# EAGLE design HDC1080 (EAGLE 7.5.0)
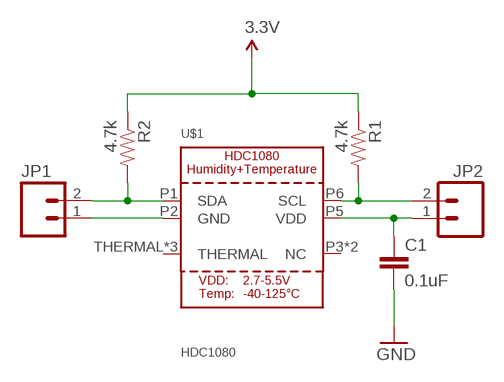
[diagram p0: schematic, sheet 1]

## Parts
C1  0.1uF  0.1UF-25V(+80/-20%)(0603)  [0603-CAP]
JP1  M02PTH  [1X02]
JP2  M02PTH  [1X02]
R1  4.7k  RESISTOR0805-RES  [0805]
R2  4.7k  RESISTOR0805-RES  [0805]
U$1  HDC1080  [PWSON-6]

## Nets
3.3V: C1.1 JP2.1 R1.1 R2.1 U$1.P5(VDD)
GND: C1.2 JP1.1 U$1.P2(GND)
SCL: JP2.2 R1.2 U$1.P6(SCL)
SDA: JP1.2 R2.2 U$1.P1(SDA)
Unconnected: U$1.P3(NC) U$1.P4(NC) U$1.THERMAL U$1.VIA1(THERMAL) U$1.VIA2(THERMAL)

## Library data of the parts
C1 = SparkFun-Capacitors:0.1UF-25V(+80/-20%)(0603): CAP-00810 Ceramic Standard decoupling cap; PROD_ID: CAP-00810
JP1 JP2 = SparkFun-Connectors:M02: Standard 2-pin 0.1" header. Use with - straight break away headers ( PRT-00116) - right angle break away headers (PRT-00553) - swiss pins (PRT-00743) - machine pins (PRT-00117) - female headers (PRT-00115) Molex polarized connector foot print use with: PRT-08233 with associated crimp pins and housings. 2.54_SCREWTERM for use with PRT-10571. 3.5mm Screw Terminal footprints for PRT-08084 5mm Screw Terminal footprints for use with PRT-08432
R1 R2 = SparkFun-Passives:RESISTOR: Resistor Basic schematic elements and footprints for 0603, 1206, and PTH resistors.
U$1 = Takaitra:HDC1080: Low Power, High Accuracy Digital Humidity Sensor with Temperature Sensor

## Board
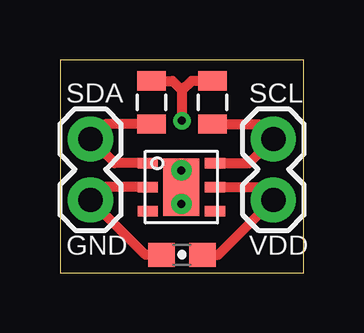
[diagram p1: board, top side]
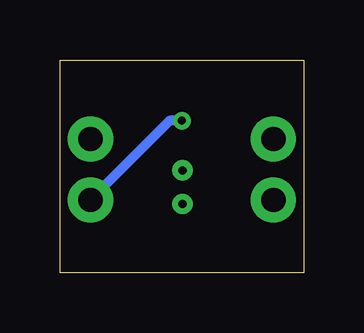
[diagram p2: board, bottom side, seen from below]

Size 10.16 x 8.89 mm. Coordinates in mm from the lower left corner, seen from the top.
Outline: 0,0 10.16,0 10.16,8.89 0,8.89 0,0
Copper layers (1*16): Top 0.035mm / dielectric 1.5mm / Bottom 0.035mm
Design rules "default *": minimum track width 6mil, minimum drill 13mil, track to track 6mil, track to pad 8mil, pad to pad 8mil, via to via 8mil, smd to smd 8mil, copper to edge 40mil, drill to drill 8mil, minimum pad ring 10mil, minimum via ring 8mil, stop-mask expansion 4mil, vias tented up to drill 0mil, thermal gap 10mil

### Footprints (pad centres in the part's own frame; a part is rotated, then mirrored left to right if it is on the bottom)
0603-CAP = smd 1.1 x 1: 1 -0.85,0; 2 0.85,0
1X02 = drill 1.016 pad 1.88: 1 0,0; 2 2.54,0
0805 = smd 0.8 x 1.2: 1 -0.9,0; 2 0.9,0
PWSON-6 = smd 0.85 x 0.45: P1 0.1,-0.5; P2 0.1,-1.5; P3 0.1,-2.5; P4 2.9,-2.5; P5 2.9,-1.5; P6 2.9,-0.5 | smd 1.5 x 2.4: THERMAL 1.5,-1.5 | drill 0.34: VIA1 1.5,-0.8; VIA2 1.5,-2.2

### Placement (x,y rotation side)
C1  5.08,0.76 180 top
JP1  1.27,3.05 90 top
JP2  8.89,3.05 90 top
R1  6.35,7.11 270 top
R2  3.81,7.11 270 top
U$1  3.56,5.08 0 top

### Tracks (layer width: path | path; a pad name or v marks a point on that pad's centre or on a via)
3.3V  (via drill 0.33 pad 0.41)
  Top 0.406: U$1.P5 8.36,3.58 JP2.1 6.6,0.76 C1.1 | R2.1 4.69,8.01 5.08,7.62 | 5.08,7.62 v5.08,6.35 | R1.1 5.47,8.01 5.08,7.62
  Bottom 0.406: v5.08,6.35 5.59,6.35 JP2.1
GND
  Top 0.406: U$1.P2 1.8,3.58 JP1.1 3.56,0.76 C1.2
SCL
  Top 0.406: U$1.P6 7.88,4.58 JP2.2 8.27,6.21 R1.2
SDA
  Top 0.406: U$1.P1 2.28,4.58 JP1.2 1.89,6.21 R2.2

### Text on the board
tNames: SDA | SCL | GND | VDD